# Altium project Battery_Management_System.PrjPcb
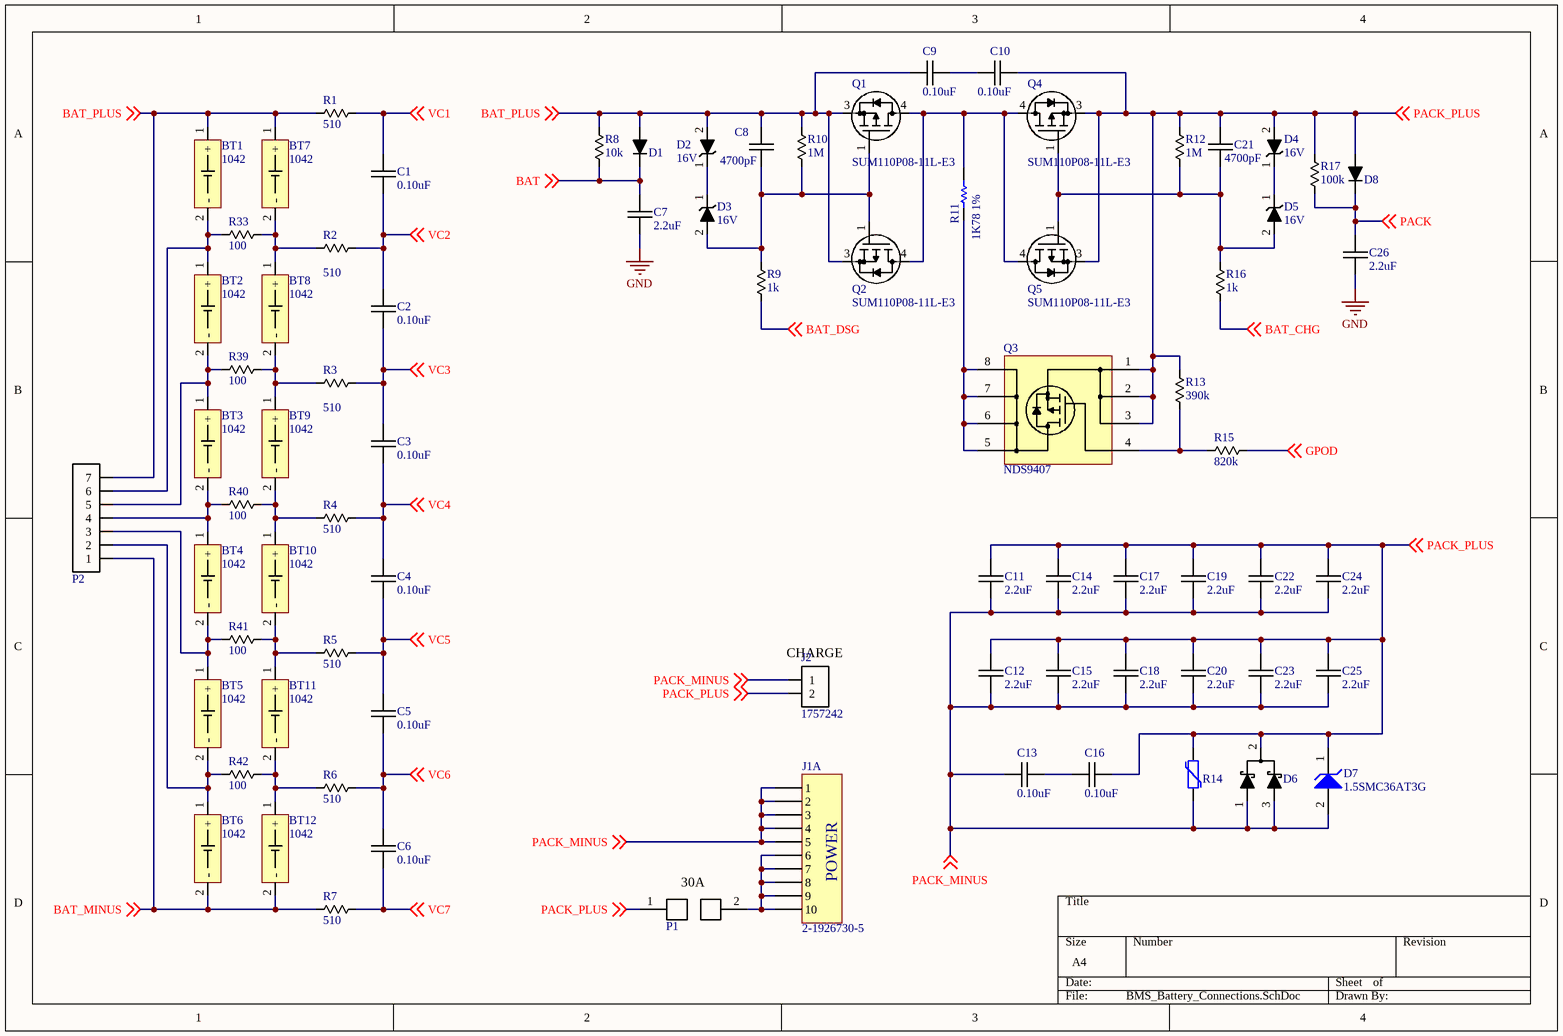
[diagram p0: BMS_Battery_Connections.SchDoc]
3 sheets, 142 parts. Net scope: global (net labels, ports and power ports of the same name join across sheets).
Board file: PCB1.PcbDoc
Sheets:
  BMS_Battery_Connections.SchDoc
  BMS_Balancer.SchDoc
  BMS_Controler.SchDoc

## Sheet BMS_Battery_Connections.SchDoc
size A4

### Parts
BT1  1042  [KEYSTONE_1042]
BT2  1042  [KEYSTONE_1042]
BT3  1042  [KEYSTONE_1042]
BT4  1042  [KEYSTONE_1042]
BT5  1042  [KEYSTONE_1042]
BT6  1042  [KEYSTONE_1042]
BT7  1042  [KEYSTONE_1042]
BT8  1042  [KEYSTONE_1042]
BT9  1042  [KEYSTONE_1042]
BT10  1042  [KEYSTONE_1042]
BT11  1042  [KEYSTONE_1042]
BT12  1042  [KEYSTONE_1042]
C1  0.10uF  [chip_0805]
C2  0.10uF  [chip_0805]
C3  0.10uF  [chip_0805]
C4  0.10uF  [chip_0805]
C5  0.10uF  [chip_0805]
C6  0.10uF  [chip_0805]
C7  2.2uF  [chip_1210]
C8  4700pF  [chip_0805]
C9  0.10uF  [chip_0805]
C10  0.10uF  [chip_0805]
C11  2.2uF  [chip_1210]
C12  2.2uF  [chip_1210]
C13  0.10uF  [chip_0805]
C14  2.2uF  [chip_1210]
C15  2.2uF  [chip_1210]
C16  0.10uF  [chip_0805]
C17  2.2uF  [chip_1210]
C18  2.2uF  [chip_1210]
C19  2.2uF  [chip_1210]
C20  2.2uF  [chip_1210]
C21  4700pF  [chip_0805]
C22  2.2uF  [chip_1210]
C23  2.2uF  [chip_1210]
C24  2.2uF  [chip_1210]
C25  2.2uF  [chip_1210]
C26  2.2uF  [chip_1210]
D1  diode_0  [sod123_0]  (value not drawn)
D2  16V  [sod523_0]
D3  16V  [sod523_0]
D4  16V  [sod523_0]
D5  16V  [sod523_0]
D6  V40PWM10C-M3/I  [DPAK_SLIM]  (value not drawn)
D7  1.5SMC36AT3G  [ONSC-SMC-2-403-03_V]
D8  diode_0  [sod123_0]  (value not drawn)
J1  2-1926730-5  [TE_CONN_2-1926730-5]  (part A of 2)
J2  1757242  [PHOENIX_1757242]
P1  conn-fuse-holder_0  [FUSE_HOLDER_KEYSTONE_3557-2]  (value not drawn)
P2  conn-7x1_0  [HDDR_7x1_0]  (value not drawn)
Q1  SUM110P08-11L-E3  [D2PAK-3_1]
Q2  SUM110P08-11L-E3  [D2PAK-3_1]
Q3  NDS9407  [SO-8]
Q4  SUM110P08-11L-E3  [D2PAK-3_1]
Q5  SUM110P08-11L-E3  [D2PAK-3_1]
R1  510  [chip_0805]
R2  510  [chip_0805]
R3  510  [chip_0805]
R4  510  [chip_0805]
R5  510  [chip_0805]
R6  510  [chip_0805]
R7  510  [chip_0805]
R8  10k  [chip_0805]
R9  1k  [chip_0805]
R10  1M  [chip_0805]
R11  1K78 1%  [RESC2512(6432)_L]
R12  1M  [chip_0805]
R13  390k  [chip_0805]
R14  MOV_0  [chip_1210]  (value not drawn)
R15  820k  [chip_0805]
R16  1k  [chip_0805]
R17  100k  [chip_0805]
R33  100  [chip_0805]
R39  100  [chip_0805]
R40  100  [chip_0805]
R41  100  [chip_0805]
R42  100  [chip_0805]

### Nets
GND: C7.2 C26.2
BAT: C7.1 D1.1 R8.2 ; off-sheet BAT
BAT_CHG: R16.2 ; off-sheet BAT_CHG
BAT_DSG: R9.2 ; off-sheet BAT_DSG
BAT_MINUS: BT6.2(-) BT12.2(-) P2.1 R7.1 ; off-sheet BAT_MINUS
BAT_PLUS: BT1.1(+) BT7.1(+) C8.1 C9.1 D1.2 D2.2 P2.7 Q1.3(S) Q2.3(S) R1.1 R8.1 R10.1 ; off-sheet BAT_PLUS
GPOD: R15.2 ; off-sheet GPOD
PACK: C26.1 D8.1 R17.2 ; off-sheet PACK
PACK_MINUS: C11.2 C12.2 C13.2 C14.2 C15.2 C17.2 C18.2 C19.2 C20.2 C22.2 C23.2 C24.2 C25.2 D6.1(A) D6.3(A) D7.2(A) J1.1 J1.2 J1.3 J1.4 J1.5 J2.1 R14.1 ; off-sheet PACK_MINUS
PACK_PLUS: C10.2 C11.1 C12.1 C14.1 C15.1 C16.1 C17.1 C18.1 C19.1 C20.1 C21.1 C22.1 C23.1 C24.1 C25.1 D4.2 D6.2(K) D7.1(K) D8.2 J2.2 P1.1 Q3.1(S) Q3.2(S) Q3.3(S) Q4.3(S) Q5.3(S) R12.1 R13.1 R14.2 R17.1 ; off-sheet PACK_PLUS
VC1: C1.1 R1.2 ; off-sheet VC1
VC2: C1.2 C2.1 R2.2 ; off-sheet VC2
VC3: C2.2 C3.1 R3.2 ; off-sheet VC3
VC4: C3.2 C4.1 R4.2 ; off-sheet VC4
VC5: C4.2 C5.1 R5.2 ; off-sheet VC5
VC6: C5.2 C6.1 R6.2 ; off-sheet VC6
VC7: C6.2 R7.2 ; off-sheet VC7
NetBT1_2: BT1.2(-) BT2.1(+) P2.6 R33.1
NetBT2_2: BT2.2(-) BT3.1(+) P2.5 R39.1
NetBT3_2: BT3.2(-) BT4.1(+) P2.4 R40.1
NetBT4_2: BT4.2(-) BT5.1(+) P2.3 R41.1
NetBT5_2: BT5.2(-) BT6.1(+) P2.2 R42.1
NetBT7_2: BT7.2(-) BT8.1(+) R2.1 R33.2
NetBT8_2: BT8.2(-) BT9.1(+) R3.1 R39.2
NetBT9_2: BT9.2(-) BT10.1(+) R4.1 R40.2
NetBT10_2: BT10.2(-) BT11.1(+) R5.1 R41.2
NetBT11_2: BT11.2(-) BT12.1(+) R6.1 R42.2
NetC8_2: C8.2 D3.2 Q1.1(G) Q2.1(G) R9.1 R10.2
NetC9_2: C9.2 C10.1
NetC13_1: C13.1 C16.2
NetC21_2: C21.2 D5.2 Q4.1(G) Q5.1(G) R12.2 R16.1
NetD2_1: D2.1 D3.1
NetD4_1: D4.1 D5.1
NetJ1_6: J1.6 J1.7 J1.8 J1.9 J1.10 P1.2
NetQ1_4: Q1.4(D) Q2.4(D) Q4.4(D) Q5.4(D) R11.2
NetQ3_4: Q3.4(G) R13.2 R15.1
NetQ3_5: Q3.5(D) Q3.6(D) Q3.7(D) Q3.8(D) R11.1

### Notes on the sheet
- (near J2) CHARGE
- (near P1) 30A
- (in symbol CONN-00093, part A) POWER

### Library data of the parts
BT1-BT12 = CONN-00077: Battery Holder, 18650, SMD; Manufacturer: Keystone; Positions per level: 2; Levels: 1; Part Number: CONN-00077; Type: Battery Holder; Manufacturer PN: 1042; Cost: 2.76
C1-C6 C9 C10 C13 C16 = CAP-00072: CAP, 0.10uF, 10%, 50V, X7R, 0805; Manufacturer: Murata; Manufacturer PN: GRM21BR71H104KA01K; Part Number: CAP-00072; Capacitance: 0.10uF; Tolerance: 10%; Voltage Rating: 50V; Type: X7R
C7 C11 C12 C14 C15 C17-C20 C22-C26 = CAP-00536: CAP, 2.2uF, ±20%, 100V, X7R, 0603; Manufacturer: TDK; Manufacturer PN: C3225X7R2A225M230AB; Part Number: CAP-00536; Capacitance: 2.2uF; Tolerance: ±20%; Voltage Rating: 100V; Type: X7R; Cost: $0.88
C8 C21 = CAP-00032: CAP, 4700pF, 10%, 100V, X7R, 0805; Manufacturer: Murata; Manufacturer PN: GRM219R72A472KA01D; Part Number: CAP-00032; Capacitance: 4700pF; Tolerance: 10%; Voltage Rating: 100V; Type: X7R
D1 D8 = DIO-00060: Dio, Silicon, 200mA, 1V, 100V, SOD-123; Manufacturer: ON Semi; Manufacturer PN: SMMSD4148T3G; Forward Voltage: 1.0V; Part Number: DIO-00060; Reverse Breakdown Voltage: 100V; Current Rating: 200mA; Type: Silicon; Cost: 0.38
D2-D5 = DIO-00082: Dio, Zener, 16V 300mW, SOD-523; Manufacturer: Nexperia; Manufacturer PN: BZX585-C16,115; Forward Voltage: 1.1V; Tolerance: 5%; Current Rating: 100mA; Part Number: DIO-00082; Reverse Breakdown Voltage: 16V; Power Rating: 300mW; Type: Zener; Cost: 0.25
D6 = DIO-00081: Dio, Schottky Array, Dual, Common Cathode, 100V 20A, SLIM DPAK; Manufacturer: Vishay; Forward Voltage: 0.89V; Part Number: DIO-00081; Reverse Breakdown Voltage: 100V; Current Rating: 20A; Type: Schottky; Manufacturer PN: V40PWM10C-M3/I; Cost: 1.37
D7 = CMP-1061-00497-1: 1500 W Peak Power Zener Transient Voltage Suppressor, Unidirectional, 2-Pin SMC, Pb-Free, Tape and Reel; Manufacturer: On Semiconductor; IR Max (uA): 5; PPK Max (W): 1500; V(BR) Typ (V): 36; Direction: Unidirectional; ComponentLink3URL: http://www.onsemi.com/pub_link/Collateral/403-03.PDF; Packing: Tape and Reel; PackageVersion: Rev. E, 08/2005; ComponentLink3Description: Package Specification; RoHS: Pb-Free; ComponentLink2URL: http://www.onsemi.com/pub_link/Collateral/1.5SMC6.8AT3-D.PDF; PackageDescription: 2-Pin Small Molded Package, J-Bend Lead, Body 5.845 x 6.855 mm; ComponentLink2Description: Datasheet; ComponentLink1URL: http://www.onsemi.com/; PackageReference: SMC-2-403-03; DatasheetVersion: Rev. 10; Mounting Technology: Surface Mount; PartNumber: 1.5SMC36AT3G; ComponentLink1Description: Manufacturer URL
J1 = CONN-00093: Backplane Header, Blades and Pins, Edge Mount Right Angle, 10 Power 25 Signal; Manufacturer: TE Connectivity; Positions per level: 35; Levels: 1; Part Number: CONN-00093; Type: Header; Manufacturer PN: 2-1926730-5; Cost: 11.68
J2 = CONN-00102: Terminal Blk Header, 2 Pos, 5.08mm, 12A, Right-Angle; Manufacturer: Phoenix Contact; Positions per level: 2; Levels: 1; Part Number: CONN-00102; Type: Terminal Block; Manufacturer PN: 1757242; Cost: 0.64
P1 = CONN-00015: Fuse Holder, 30A, 500V, LP-Mini 897, ATOF 257; Manufacturer: Keystone Electronics; Manufacturer PN: 3557-2; Positions per level: 2; Levels: 1; Current: 30; Part Number: CONN-00015; Cost: 1.03
P2 = CONN-00105: Header, 7x1, 0.1"; Manufacturer: Samtec; Manufacturer PN: TSW-107-07-F-S; Positions per level: 7; Levels: 1; Part Number: CONN-00105; Type: Header; Cost: 0.61
Q1 Q2 Q4 Q5 = XSTR-00050: XSTR, MOSFET P-Channel, 80V 110A, D2PAK; Manufacturer: Vishay Siliconix; Max Power: 375W; Type: PMOS; Vgs/Vce: 3V; Part Number: XSTR-00050; Max Voltage: 80V; Max Current: 110A; Manufacturer PN: SUM110P08-11L-E3; Cost: 4.43
Q3 = XSTR-00036: XSTR PFET, 3A, 60V, 2.5W, SOIC-8; Manufacturer: ON Semi; Vgs/Vce: 1.6V; Part Number: XSTR-00036; Max Voltage: 60V; Max Current: 3A; Max Power: 2.5W; Type: PFET; Manufacturer PN: NDS9407; Cost: 0.78
R1-R7 = RES-00240: RES SMD 510 OHM 1% 1/8W 0805; Manufacturer: Rohm Semiconductor; Manufacturer PN: KTR10EZPF5100; Power Rating: 0.125W; Part Number: RES-00240; Resistance: 510; Tolerance: 1%
R8 = RES-00307: RES SMD 10K OHM 1% 1/8W 0805; Manufacturer: Rohm Semiconductor; Manufacturer PN: KTR10EZPF1002; Power Rating: 0.125W; Part Number: RES-00307; Resistance: 10k; Tolerance: 1%
R9 R16 = RES-00361: RES SMD 1K OHM 1% 1/8W 0805; Manufacturer: Rohm Semiconductor; Manufacturer PN: KTR10EZPF1001; Power Rating: 0.125W; Part Number: RES-00361; Resistance: 1k; Tolerance: 1%
R10 R12 = RES-00363: RES SMD 1M OHM 1% 1/8W 0805; Manufacturer: Rohm Semiconductor; Manufacturer PN: KTR10EZPF1004; Power Rating: 0.125W; Part Number: RES-00363; Resistance: 1M; Tolerance: 1%
R11 = CMP-1018-00536-1: 1K78 1W 1% 2512 (6432 Metric)  SMD; Case-EIA: 2512; Value: 1780.00 Ohm; Case-Metric: 6432; Tolerance: 1 %; Power: 1 W; Technology: SMT
R13 = RES-00455: RES SMD 390K OHM 1% 1/8W 0805; Manufacturer: Rohm Semiconductor; Manufacturer PN: KTR10EZPF3903; Power Rating: 0.125W; Part Number: RES-00455; Resistance: 390k; Tolerance: 1%
R14 = MISC-00057: Varistor, Ceramic, 47V 300A 2J, 1210; Manufacturer: TDK; Manufacturer PN: B72530T0300K062; Part Number: MISC-00057; Cost: 0.65
R15 = RES-00567: RES SMD 820K OHM 1% 1/8W 0805; Manufacturer: Rohm Semiconductor; Manufacturer PN: KTR10EZPF8203; Power Rating: 0.125W; Part Number: RES-00567; Resistance: 820k; Tolerance: 1%
R17 = RES-00302: RES SMD 100K OHM 1% 1/8W 0805; Manufacturer: Rohm Semiconductor; Manufacturer PN: KTR10EZPF1003; Power Rating: 0.125W; Part Number: RES-00302; Resistance: 100k; Tolerance: 1%
R33 R39-R42 = RES-00179: RES SMD 100 OHM 1% 1/8W 0805; Manufacturer: Rohm Semiconductor; Manufacturer PN: KTR10EZPF1000; Power Rating: 0.125W; Part Number: RES-00179; Resistance: 100; Tolerance: 1%

## Sheet BMS_Balancer.SchDoc
size A4
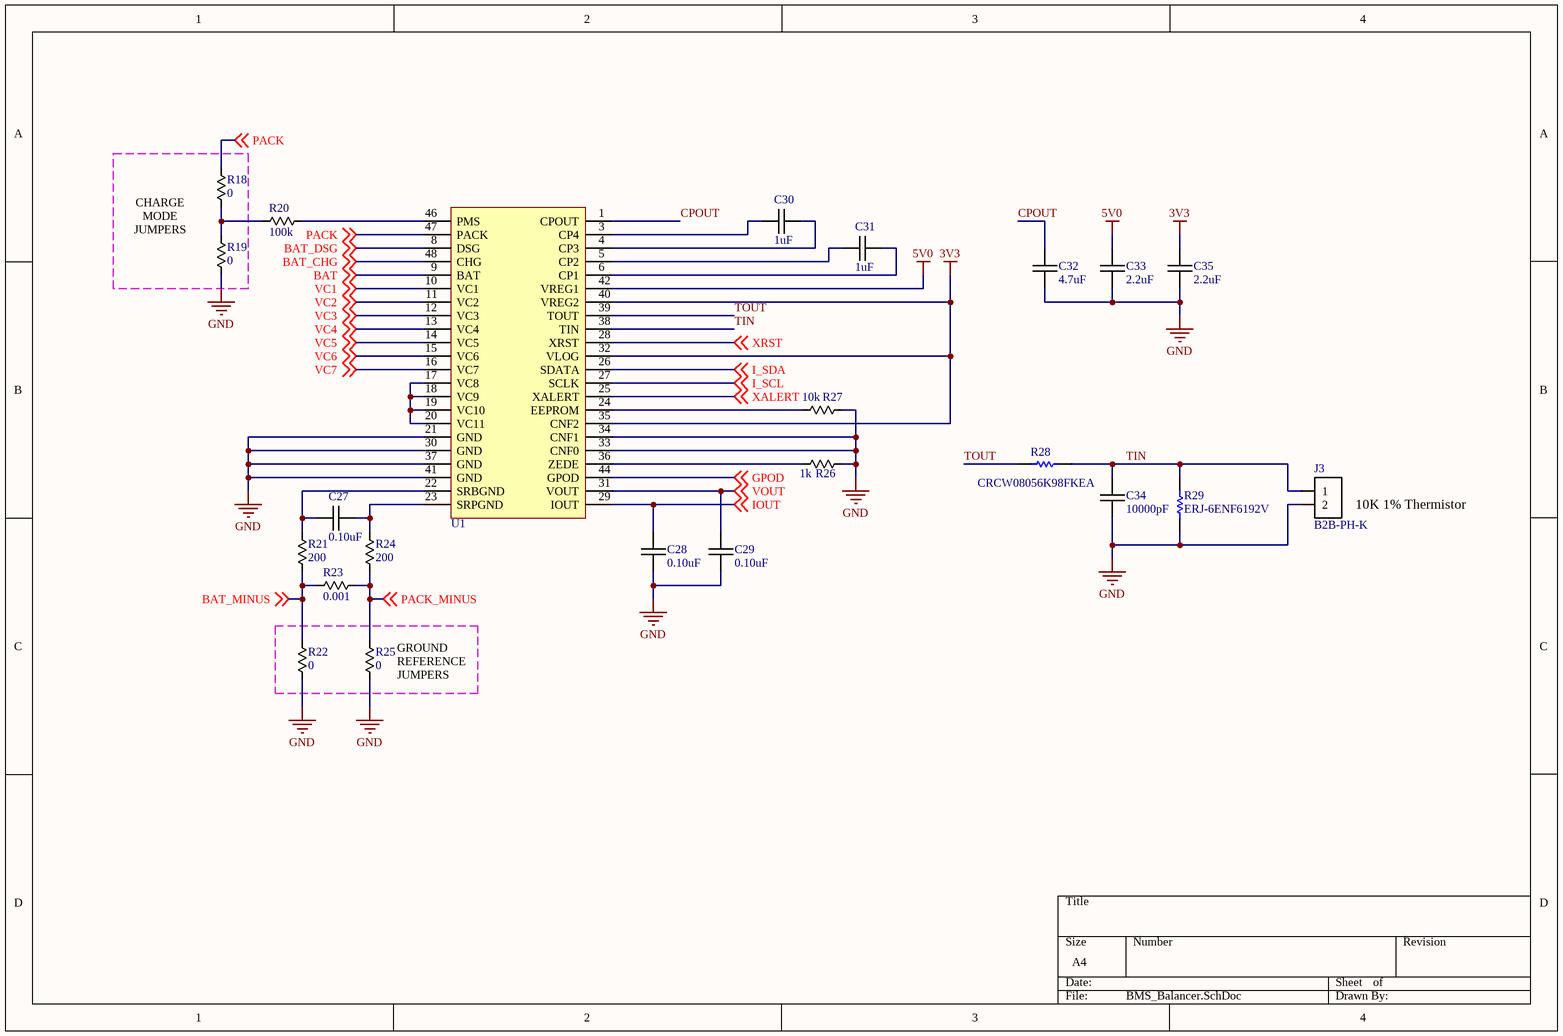
[diagram p1: BMS_Balancer.SchDoc]

### Parts
C27  0.10uF  [chip_0805]
C28  0.10uF  [chip_0805]
C29  0.10uF  [chip_0805]
C30  1uF  [chip_0805]
C31  1uF  [chip_0805]
C32  4.7uF  [chip_0805]
C33  2.2uF  [chip_1210]
C34  10000pF  [chip_0805]
C35  2.2uF  [chip_1210]
J3  B2B-PH-K  [JST_PHR_2_0]
R18  0  [chip_0805]
R19  0  [chip_0805]
R20  100k  [chip_0805]
R21  200  [chip_0805]
R22  0  [chip_0805]
R23  0.001  [chip_2512]
R24  200  [chip_0805]
R25  0  [chip_0805]
R26  1k  [chip_0805]
R27  10k  [chip_0805]
R28  CRCW08056K98FKEA  [RESC2013X50X30ML20T20]
R29  ERJ-6ENF6192V  [RESC2013X70X40ML20T20]
U1  BQ77PL900  [SSOP-48_0]  (value not drawn)

### Nets
3V3: C35.1 U1.32(VLOG) U1.35(CNF2) U1.40(VREG2)
5V0: C33.1 U1.42(VREG1)
GND: C28.2 C29.2 C32.1 C33.2 C34.2 C35.2 J3.2 R19.2 R22.2 R25.2 R26.2 R27.2 R29.1 U1.21(GND) U1.30(GND) U1.33(CNF0) U1.34(CNF1) U1.37(GND) U1.41(GND)
BAT: U1.9(BAT) ; off-sheet BAT
BAT_CHG: U1.48(CHG) ; off-sheet BAT_CHG
BAT_DSG: U1.8(DSG) ; off-sheet BAT_DSG
BAT_MINUS: R21.2 R22.1 R23.2 ; off-sheet BAT_MINUS
CPOUT: C32.2 U1.1(CPOUT)
GPOD: U1.44(GPOD) ; off-sheet GPOD
I_SCL: U1.27(SCLK) ; off-sheet I_SCL
I_SDA: U1.26(SDATA) ; off-sheet I_SDA
IOUT: C28.1 U1.29(IOUT) ; off-sheet IOUT
PACK: R18.1 U1.47(PACK) ; off-sheet PACK
PACK_MINUS: R23.1 R24.2 R25.1 ; off-sheet PACK_MINUS
TIN: C34.1 J3.1 R28.1 R29.2 U1.38(TIN)
TOUT: R28.2 U1.39(TOUT)
VC1: U1.10(VC1) ; off-sheet VC1
VC2: U1.11(VC2) ; off-sheet VC2
VC3: U1.12(VC3) ; off-sheet VC3
VC4: U1.13(VC4) ; off-sheet VC4
VC5: U1.14(VC5) ; off-sheet VC5
VC6: U1.15(VC6) ; off-sheet VC6
VC7: U1.16(VC7) ; off-sheet VC7
VOUT: C29.1 U1.31(VOUT) ; off-sheet VOUT
XALERT: U1.25(XALERT) ; off-sheet XALERT
XRST: U1.28(XRST) ; off-sheet XRST
NetC27_1: C27.1 R21.1 U1.22(SRBGND)
NetC27_2: C27.2 R24.1 U1.23(SRPGND)
NetC30_1: C30.1 U1.4(CP3)
NetC30_2: C30.2 U1.3(CP4)
NetC31_1: C31.1 U1.6(CP1)
NetC31_2: C31.2 U1.5(CP2)
NetR18_2: R18.2 R19.1 R20.1
NetR20_2: R20.2 U1.46(PMS)
NetR26_1: R26.1 U1.36(ZEDE)
NetR27_1: R27.1 U1.24(EEPROM)
NetU1_17: U1.17(VC8) U1.18(VC9) U1.19(VC10) U1.20(VC11)

Not connected (* = marked no-connect by the designer): U1 2(NC) 7(NC) 43(NC) 45(NC)

### Notes on the sheet
- CHARGE
  MODE
  JUMPERS
- (near J3) 10K 1% Thermistor
- (near R25) GROUND
  REFERENCE
  JUMPERS

### Library data of the parts
C27-C29 = CAP-00072: as C1 on sheet BMS_Battery_Connections; Part Number: CAP-00072; Capacitance: 0.10uF; Tolerance: 10%; Voltage Rating: 50V; Type: X7R
C30 C31 = CAP-00109: CAP, 1uF, 10%, 50V, X7R, 0805; Manufacturer: Murata; Manufacturer PN: GRM21BR71H105KA12L; Part Number: CAP-00109; Capacitance: 1uF; Tolerance: 10%; Voltage Rating: 50V; Type: X7R
C32 = CAP-00128: CAP, 4.7uF, 10%, 25V, X7R, 0805; Manufacturer: Murata; Manufacturer PN: GRM21BR71E475KA73L; Part Number: CAP-00128; Capacitance: 4.7uF; Tolerance: 10%; Voltage Rating: 25V; Type: X7R
C33 C35 = CAP-00536: as C7 on sheet BMS_Battery_Connections; Part Number: CAP-00536; Capacitance: 2.2uF; Tolerance: ±20%; Voltage Rating: 100V; Type: X7R; Cost: $0.88
C34 = CAP-00045: CAP, 10000pF, 10%, 25V, X7R, 0805; Manufacturer: Murata; Manufacturer PN: GRM216R71E103KA01D; Part Number: CAP-00045; Capacitance: 10000pF; Tolerance: 10%; Voltage Rating: 25V; Type: X7R
J3 = CONN-00048: JST PH 2x1, THT, 2.00mm Pitch; Positions per level: 2; Levels: 1; Part Number: CONN-00048; Type: Header; Manufacturer: JST; Manufacturer PN: B2B-PH-K; Cost: 0.19
R18 R19 R22 R25 = RES-00720: RES SMD 0 OHM 1/8W 0805 Thick Film; Manufacturer: Stackpole; Manufacturer PN: RMCF0805ZT0R00; Tolerance: Jumper; Part Number: RES-00720; Resistance: 0; Power Rating: 1/8W; Cost: 0.1
R20 = RES-00302: as R17 on sheet BMS_Battery_Connections; Part Number: RES-00302; Resistance: 100k; Tolerance: 1%
R21 R24 = RES-00197: RES SMD 200 OHM 1% 1/8W 0805; Manufacturer: Rohm Semiconductor; Manufacturer PN: KTR10EZPF2000; Power Rating: 0.125W; Part Number: RES-00197; Resistance: 200; Tolerance: 1%
R23 = RES-00002: RES, 0.001, 1%, 1W, 2512; Manufacturer: Yageo; Manufacturer PN: PA2512FKF070R001E; Part Number: RES-00002; Resistance: 0.001; Tolerance: 1%; Power Rating: 1W
R26 = RES-00361: as R9 on sheet BMS_Battery_Connections; Part Number: RES-00361; Resistance: 1k; Tolerance: 1%
R27 = RES-00307: as R8 on sheet BMS_Battery_Connections; Part Number: RES-00307; Resistance: 10k; Tolerance: 1%
R28 = CMP-2001-04091-1: Manufacturer: Vishay Dale; Part Number: CRCW08056K98FKEA
R29 = CMP-2001-00256-1: Manufacturer: Panasonic; Part Number: ERJ-6ENF6192V
U1 = PWREG-00024: Batt Manager, Li-Ion, 5-10 cells, bq77PL900; Manufacturer: TI; Manufacturer PN: BQ77PL900DLR; Voltage Range In: -0.3 - 60V; Reg Type: Batt Mngr; Fixed/Adj: Fixed; Part Number: PWREG-00024; Cost: 6.36

## Sheet BMS_Controler.SchDoc
size A4
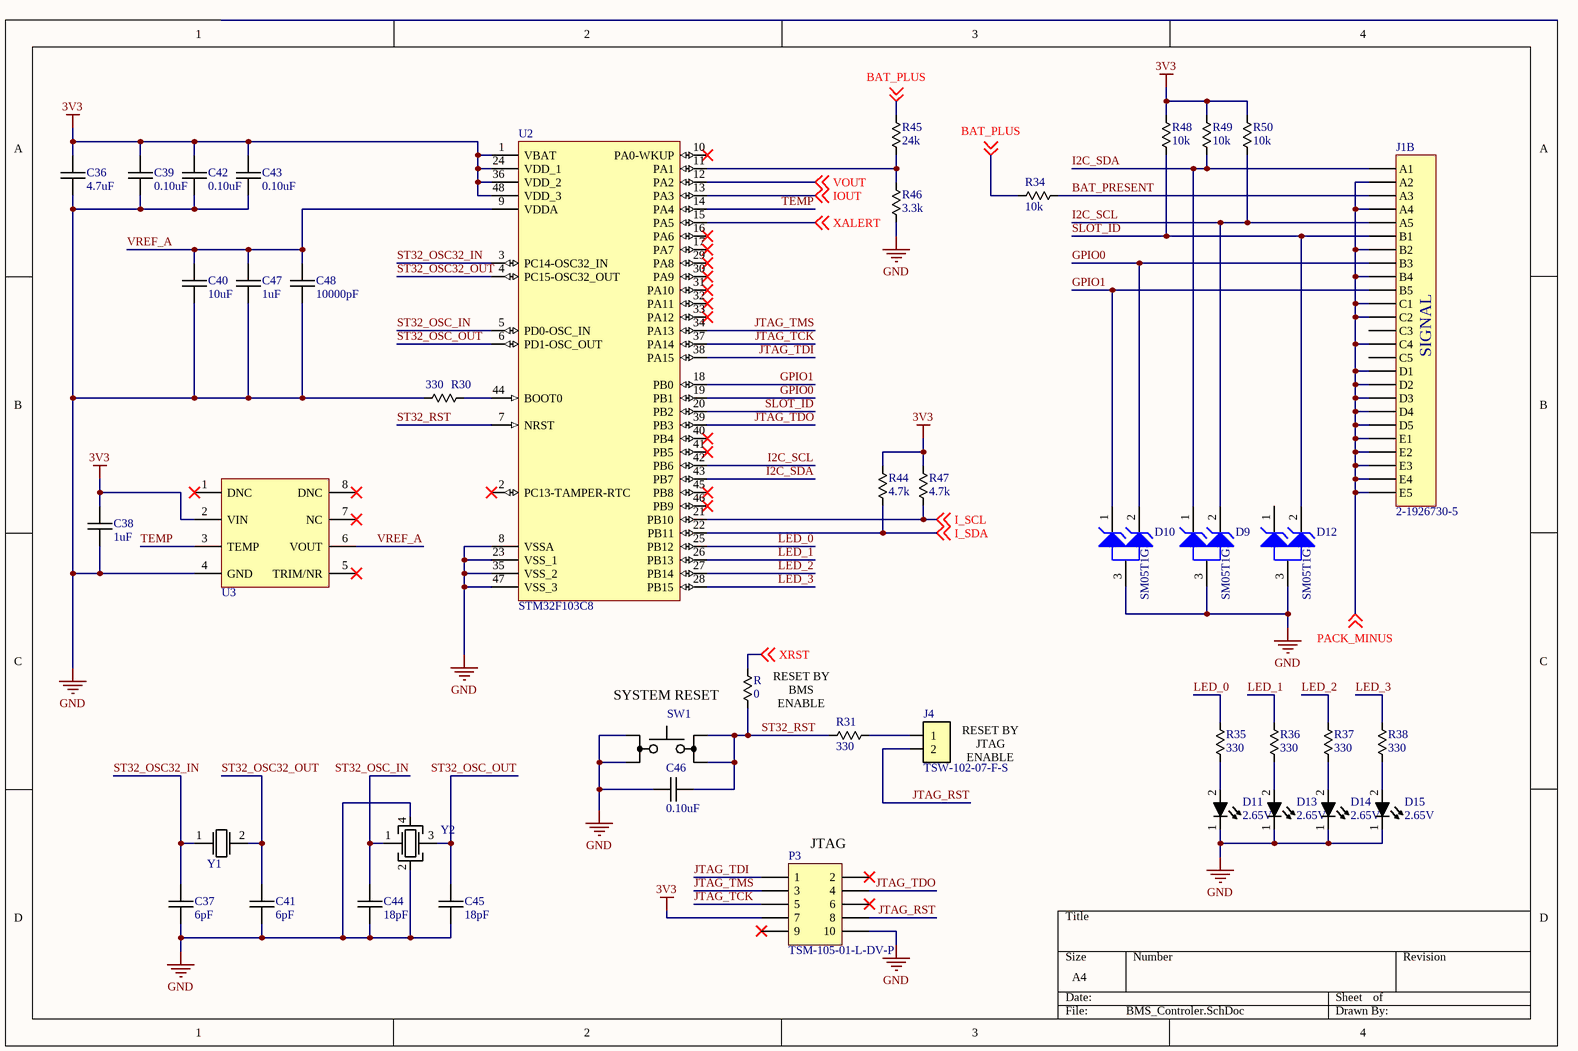
[diagram p2: BMS_Controler.SchDoc]

### Parts
C36  4.7uF  [chip_0805]
C37  6pF  [chip_0603]
C38  1uF  [chip_0805]
C39  0.10uF  [chip_0805]
C40  10uF  [chip_0805]
C41  6pF  [chip_0603]
C42  0.10uF  [chip_0805]
C43  0.10uF  [chip_0805]
C44  18pF  [chip_0603]
C45  18pF  [chip_0603]
C46  0.10uF  [chip_0805]
C47  1uF  [chip_0805]
C48  10000pF  [chip_0805]
D9  SM05T1G  [ONSC-SOT-23-3-318-08_V]
D10  SM05T1G  [ONSC-SOT-23-3-318-08_V]
D11  2.65V  [APA2107]
D12  SM05T1G  [ONSC-SOT-23-3-318-08_V]
D13  2.65V  [APA2107]
D14  2.65V  [APA2107]
D15  2.65V  [APA2107]
J1  2-1926730-5  [TE_CONN_2-1926730-5]  (part B of 2)
J4  TSW-102-07-F-S  [HDDR_2x1_0]
P3  TSM-105-01-L-DV-P  [SAMTEC_SMD_HDDR_5x2]
R30  330  [chip_0805]
R31  330  [chip_0805]
R34  10k  [chip_0805]
R35  330  [chip_0805]
R36  330  [chip_0805]
R37  330  [chip_0805]
R38  330  [chip_0805]
R43  0  [chip_0805]
R44  4.7k  [chip_0805]
R45  24k  [chip_0805]
R46  3.3k  [chip_0805]
R47  4.7k  [chip_0805]
R48  10k  [chip_0805]
R49  10k  [chip_0805]
R50  10k  [chip_0805]
SW1  SW_1P1T_2  [B3FS-1000]  (value not drawn)
U2  STM32F103C8  [LQFP48_0]
U3  REF50xx  [SO-8_1]  (value not drawn)
Y1  osc_xtal_2p_0  [ABS25_OSC]  (value not drawn)
Y2  osc_xtal_4p_1-3  [ECX-53B]  (value not drawn)

### Nets
3V3: C36.2 C38.2 C39.1 C42.1 C43.1 P3.7 R44.1 R47.1 R48.2 R49.2 R50.2 U2.1(VBAT) U2.24(VDD_1) U2.36(VDD_2) U2.48(VDD_3) U3.2(VIN)
GND: C36.1 C37.2 C38.1 C39.2 C40.2 C41.1 C42.2 C43.2 C44.2 C45.2 C46.1 C47.1 C48.2 D9.3(A) D10.3(A) D11.1 D12.3(A) D13.1 D14.1 D15.1 P3.10 R30.1 R46.2 SW1.1 SW1.2 U2.8(VSSA) U2.23(VSS_1) U2.35(VSS_2) U2.47(VSS_3) U3.4(GND) Y2.2(GND) Y2.4(GND)
BAT_PLUS: R34.1 R45.1 ; off-sheet BAT_PLUS
BAT_PRESENT: J1.A3 R34.2
GPIO0: D10.2(K2) J1.B3 U2.19(PB1)
GPIO1: D10.1(K1) J1.B5 U2.18(PB0)
I2C_SCL: D9.2(K2) J1.A5 R50.1 U2.42(PB6)
I2C_SDA: D9.1(K1) J1.A1 R49.1 U2.43(PB7)
I_SCL: R47.2 U2.21(PB10) ; off-sheet I_SCL
I_SDA: R44.2 U2.22(PB11) ; off-sheet I_SDA
IOUT: U2.13(PA3) ; off-sheet IOUT
JTAG_RST: J4.2 P3.8
JTAG_TCK: P3.5 U2.37(PA14)
JTAG_TDI: P3.1 U2.38(PA15)
JTAG_TDO: P3.4 U2.39(PB3)
JTAG_TMS: P3.3 U2.34(PA13)
LED_0: R35.1 U2.25(PB12)
LED_1: R36.1 U2.26(PB13)
LED_2: R37.1 U2.27(PB14)
LED_3: R38.1 U2.28(PB15)
PACK_MINUS: J1.A2 J1.A4 J1.B2 J1.B4 J1.C1 J1.C2 J1.C4 J1.D1 J1.D2 J1.D3 J1.D4 J1.D5 J1.E1 J1.E2 J1.E3 J1.E4 J1.E5 ; off-sheet PACK_MINUS
SLOT_ID: D12.2(K2) J1.B1 R48.1 U2.20(PB2)
ST32_OSC32_IN: C37.1 U2.3(PC14-OSC32_IN) Y1.1
ST32_OSC32_OUT: C41.2 U2.4(PC15-OSC32_OUT) Y1.2
ST32_OSC_IN: C44.1 U2.5(PD0-OSC_IN) Y2.1
ST32_OSC_OUT: C45.1 U2.6(PD1-OSC_OUT) Y2.3
ST32_RST: C46.2 R31.1 R43.2 SW1.3 SW1.4 U2.7(NRST)
TEMP: U2.14(PA4) U3.3(TEMP)
VOUT: U2.12(PA2) ; off-sheet VOUT
VREF_A: C40.1 C47.2 C48.1 U2.9(VDDA) U3.6(VOUT)
XALERT: U2.15(PA5) ; off-sheet XALERT
XRST: R43.1 ; off-sheet XRST
NetD11_2: D11.2 R35.2
NetD13_2: D13.2 R36.2
NetD14_2: D14.2 R37.2
NetD15_2: D15.2 R38.2
NetJ4_1: J4.1 R31.2
NetR30_2: R30.2 U2.44(BOOT0)
NetR45_2: R45.2 R46.1 U2.11(PA1)

Not connected (* = marked no-connect by the designer): D12 1(K1); J1 C3 C5; P3 2* 6* 9*; U2 2(PC13-TAMPER-RTC)* 10(PA0-WKUP)* 16(PA6)* 17(PA7)* 29(PA8)* 30(PA9)* 31(PA10)* 32(PA11)* 33(PA12)* 40(PB4)* 41(PB5)* 45(PB8)* 46(PB9)*; U3 1(DNC)* 5(TRIM/NR)* 7(NC)* 8(DNC)*

### Notes on the sheet
- SYSTEM RESET
- (near R43) RESET BY BMS
  ENABLE
- (near J4) RESET BY JTAG
  ENABLE
- (near P3) JTAG
- (in symbol CONN-00093, part B) SIGNAL

### Library data of the parts
C36 = CAP-00128: as C32 on sheet BMS_Balancer; Part Number: CAP-00128; Capacitance: 4.7uF; Tolerance: 10%; Voltage Rating: 25V; Type: X7R
C37 C41 = CAP-00538: CAP, 6pF, ±10%, 50V, C0G, 0603; Part Number: CAP-00538; Capacitance: 6pF; Tolerance: ±10%; Voltage Rating: 50V; Type: C0G
C38 C47 = CAP-00109: as C30 on sheet BMS_Balancer; Part Number: CAP-00109; Capacitance: 1uF; Tolerance: 10%; Voltage Rating: 50V; Type: X7R
C39 C42 C43 C46 = CAP-00072: as C1 on sheet BMS_Battery_Connections; Part Number: CAP-00072; Capacitance: 0.10uF; Tolerance: 10%; Voltage Rating: 50V; Type: X7R
C40 = CAP-00131: CAP, 10uF, 10%, 10V, X7R, 0805; Manufacturer: Murata; Manufacturer PN: GRM21BR71A106KA73L; Part Number: CAP-00131; Capacitance: 10uF; Tolerance: 10%; Voltage Rating: 10V; Type: X7R
C44 C45 = CAP-00417: CAP, 18pF, ±1%, 50V, C0G, 0603; Manufacturer: Murata; Manufacturer PN: GRM1885C1H180FA01J; Part Number: CAP-00417; Capacitance: 18pF; Tolerance: ±1%; Voltage Rating: 50V; Type: C0G
C48 = CAP-00045: as C34 on sheet BMS_Balancer; Part Number: CAP-00045; Capacitance: 10000pF; Tolerance: 10%; Voltage Rating: 25V; Type: X7R
D9 D10 D12 = CMP-1061-00666-1: Transient Voltage Suppressor Diode Array, Dual Common Anode Diodes for ESD Protection, 3-Pin SOT-23, Pb-Free, Tape and Reel; Manufacturer: On Semiconductor; Direction: Unidirectional; IR Max (uA): 10; PPK Max (W): 300; ComponentLink2Description: Datasheet; PackageVersion: Rev. AP, 11/2009; ComponentLink2URL: http://www.onsemi.com/pub_link/Collateral/SM12T1-D.PDF; DatasheetVersion: Rev. 6; Packing: Tape and Reel; PartNumber: SM05T1G; ComponentLink3Description: Package Specification; ComponentLink1URL: http://www.onsemi.com/; ComponentLink3URL: http://www.onsemi.cn/pub_link/Collateral/318-08.PDF; PackageReference: SOT-23-3-318-08; ComponentLink1Description: Manufacturer URL; PackageDescription: 3-Pin Small Outline Transistor, Body 2.92 x 1.3 mm, Pitch 0.95 mm; Mounting Technology: Surface Mount; RoHS: Pb-Free
D11 D13-D15 = DIO-00083: LED, Green, SMD Right-Angle, Low-Current, Kingbright HELI2 Series; Manufacturer PN: APA2107LZGCK; Reverse Breakdown Voltage: 5V; Power Rating: 102.5mW; Current Rating: 25mA; Part Number: DIO-00083; Forward Voltage: 2.65V; Type: LED; Manufacturer: Kingbright; Cost: 0.51
J1 = CONN-00093: as J1 on sheet BMS_Battery_Connections; Part Number: CONN-00093; Type: Header; Manufacturer PN: 2-1926730-5; Cost: 11.68
J4 = CONN-00055: Header, 2x1, 0.1"; Manufacturer: Samtec; Positions per level: 2; Levels: 1; Part Number: CONN-00055; Type: Header; Manufacturer PN: TSW-102-07-F-S; Cost: 0.2
P3 = CONN-00071: Header, 5x2, 0.1", SMD; Manufacturer: Samtec; Positions per level: 5; Levels: 2; Part Number: CONN-00071; Type: Header; Manufacturer PN: TSM-105-01-L-DV-P; Cost: 1.17
R30 R31 R35-R38 = RES-00222: RES SMD 330 OHM 1% 1/8W 0805; Manufacturer: Rohm Semiconductor; Manufacturer PN: KTR10EZPF3300; Power Rating: 0.125W; Part Number: RES-00222; Resistance: 330; Tolerance: 1%
R34 R48-R50 = RES-00307: as R8 on sheet BMS_Battery_Connections; Part Number: RES-00307; Resistance: 10k; Tolerance: 1%
R43 = RES-00720: as R18 on sheet BMS_Balancer; Part Number: RES-00720; Resistance: 0; Power Rating: 1/8W; Cost: 0.1
R44 R47 = RES-00471: RES SMD 4.7K OHM 1% 1/8W 0805; Manufacturer: Rohm Semiconductor; Manufacturer PN: KTR10EZPF4701; Power Rating: 0.125W; Part Number: RES-00471; Resistance: 4.7k; Tolerance: 1%
R45 = RES-00400: RES SMD 24K OHM 1% 1/8W 0805; Manufacturer: Rohm Semiconductor; Manufacturer PN: KTR10EZPF2402; Power Rating: 0.125W; Part Number: RES-00400; Resistance: 24k; Tolerance: 1%
R46 = RES-00420: RES SMD 3.3K OHM 1% 1/8W 0805; Manufacturer: Rohm Semiconductor; Manufacturer PN: KTR10EZPF3301; Power Rating: 0.125W; Part Number: RES-00420; Resistance: 3.3k; Tolerance: 1%
SW1 = MISC-00042: Switch, SPST-NO, Tactile, 6.3x6.0mm, SMD, 50mA 24VDC; Manufacturer: Omron; Manufacturer PN: B3FS-1012P; Part Number: MISC-00042; Cost: 0.71
U2 = UCTRL-00008: STM32 M3, LQFP-48; Manufacturer: ST; Part Number: UCTRL-00008; Manufacturer PN: STM32F103C8
U3 = ANLG-00055: IC, Voltage Reference, 2.5V, 3ppm/°C, REF5020; Manufacturer: TI; Manufacturer PN: REF5025AIDR; Part Number: ANLG-00055; Cost: 3
Y1 = OSC-00003: XTAL, 32.768kHz, 6pF, 20ppm; Manufacturer: Abracon; Manufacturer PN: ABS25-32.768KHZ-6-T; ESR: 50k; Part Number: OSC-00003; Frequency: 32.768k; Load Capacitance: 6pF; Tolerance: 20ppm
Y2 = OSC-00006: XTAL, 8MHz, 10pF, 10ppm; Manufacturer: ECS Inc.; Manufacturer PN: ECS-80-10-30B-CWN-TR; Frequency: 8M; ESR: 100; Stability: 15ppm; Part Number: OSC-00006; Load Capacitance: 10pF; Tolerance: 10ppm; Cost: 0.86

## Nets that join several sheets
3V3: BMS_Balancer (C35.1 U1.32 U1.35 U1.40), BMS_Controler (16 pins)
GND: BMS_Battery_Connections (C7.2 C26.2), BMS_Balancer (19 pins), BMS_Controler (32 pins)
BAT: BMS_Battery_Connections (C7.1 D1.1 R8.2), BMS_Balancer (U1.9)
BAT_CHG: BMS_Battery_Connections (R16.2), BMS_Balancer (U1.48)
BAT_DSG: BMS_Battery_Connections (R9.2), BMS_Balancer (U1.8)
BAT_MINUS: BMS_Battery_Connections (BT6.2 BT12.2 P2.1 R7.1), BMS_Balancer (R21.2 R22.1 R23.2)
BAT_PLUS: BMS_Battery_Connections (12 pins), BMS_Controler (R34.1 R45.1)
GPOD: BMS_Battery_Connections (R15.2), BMS_Balancer (U1.44)
I_SCL: BMS_Balancer (U1.27), BMS_Controler (R47.2 U2.21)
I_SDA: BMS_Balancer (U1.26), BMS_Controler (R44.2 U2.22)
IOUT: BMS_Balancer (C28.1 U1.29), BMS_Controler (U2.13)
PACK: BMS_Battery_Connections (C26.1 D8.1 R17.2), BMS_Balancer (R18.1 U1.47)
PACK_MINUS: BMS_Battery_Connections (23 pins), BMS_Balancer (R23.1 R24.2 R25.1), BMS_Controler (17 pins)
VC1: BMS_Battery_Connections (C1.1 R1.2), BMS_Balancer (U1.10)
VC2: BMS_Battery_Connections (C1.2 C2.1 R2.2), BMS_Balancer (U1.11)
VC3: BMS_Battery_Connections (C2.2 C3.1 R3.2), BMS_Balancer (U1.12)
VC4: BMS_Battery_Connections (C3.2 C4.1 R4.2), BMS_Balancer (U1.13)
VC5: BMS_Battery_Connections (C4.2 C5.1 R5.2), BMS_Balancer (U1.14)
VC6: BMS_Battery_Connections (C5.2 C6.1 R6.2), BMS_Balancer (U1.15)
VC7: BMS_Battery_Connections (C6.2 R7.2), BMS_Balancer (U1.16)
VOUT: BMS_Balancer (C29.1 U1.31), BMS_Controler (U2.12)
XALERT: BMS_Balancer (U1.25), BMS_Controler (U2.15)
XRST: BMS_Balancer (U1.28), BMS_Controler (R43.1)